# Altium schematic sheet Buzzer, LED.SchDoc
size Letter; Organization: Cegep Limoilou; Address1: 1300, 8e Avenue; Address2: Québec, QC; Address3: Canada; Address4: G1J 5L5; Revision: Enseignants; SheetNumber: 3; SheetTotal: 4; Conception: Ilyes Gharmoul; Titre: Buzzer LED Conn; Modification: Ilyes G
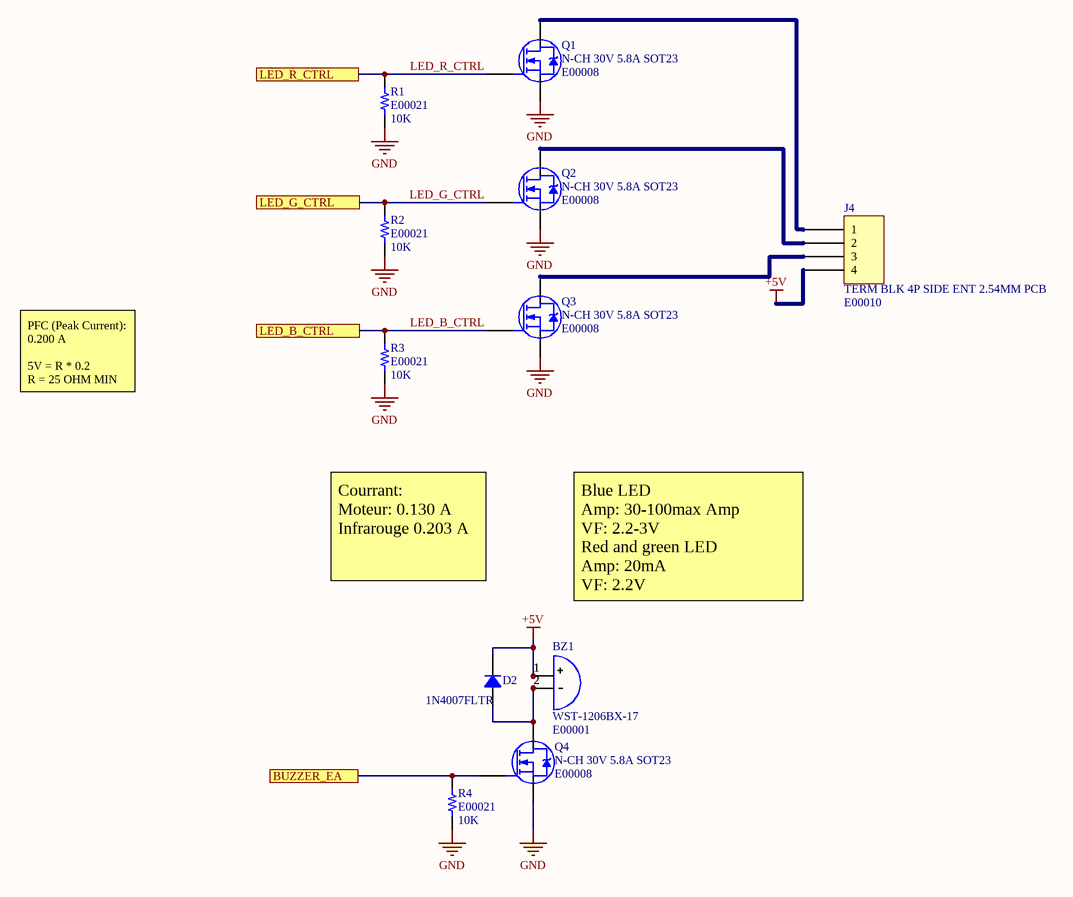
[diagram p0: Buzzer, LED.SchDoc]

## Parts
BZ1  WST-1206BX-17  ADAM Inventory Number 1: E00001  [BUZZ WST-1206BX]
D2  1N4007FLTR  [SOD123F]
J4  TERM BLK 4P SIDE ENT 2.54MM PCB  ADAM Inventory Number 1: E00010  [TERM BLOC 4P]
Q1  N-CH 30V 5.8A SOT23  ADAM Inventory Number 1: E00008  [N-CHANNEL TRANS]
Q2  N-CH 30V 5.8A SOT23  ADAM Inventory Number 1: E00008  [N-CHANNEL TRANS]
Q3  N-CH 30V 5.8A SOT23  ADAM Inventory Number 1: E00008  [N-CHANNEL TRANS]
Q4  N-CH 30V 5.8A SOT23  ADAM Inventory Number 1: E00008  [N-CHANNEL TRANS]
R1  ADAM Inventory Number 1: E00021  [RES 0603]  (hidden comment: 10K)
R2  ADAM Inventory Number 1: E00021  [RES 0603]  (hidden comment: 10K)
R3  ADAM Inventory Number 1: E00021  [RES 0603]  (hidden comment: 10K)
R4  ADAM Inventory Number 1: E00021  [RES 0603]  (hidden comment: 10K)

## Ports
BUZZER_EA, LED_B_CTRL, LED_G_CTRL, LED_R_CTRL

## Nets
+5V: BZ1.1 D2.2 J4.4
GND: Q1.2(S) Q2.2(S) Q3.2(S) Q4.2(S) R1.1 R2.1 R3.1 R4.1
BUZZER_EA: Q4.1(G) R4.2 ; port BUZZER_EA
LED_B_CTRL: Q3.1(G) R3.2 ; port LED_B_CTRL
LED_G_CTRL: Q2.1(G) R2.2 ; port LED_G_CTRL
LED_R_CTRL: Q1.1(G) R1.2 ; port LED_R_CTRL
NetBZ1_2: BZ1.2 D2.1 Q4.3(D)
NetJ4_1: J4.1 Q1.3(D)
NetJ4_2: J4.2 Q2.3(D)
NetJ4_3: J4.3 Q3.3(D)

## Notes on the sheet
- PFC (Peak Current): 0.200 A
  5V = R * 0.2
  R = 25 OHM MIN
- Courrant:
  Moteur: 0.130 A
  Infrarouge 0.203 A
- Blue LED
  Amp: 30-100max Amp
  VF: 2.2-3V
  Red and green LED
  Amp: 20mA
  VF: 2.2V
- Titre :
- Conception :
- Date :
- Modification :
- Heure :
- Révision :
- Feuille
- de
- Fichier :

## Library data of the parts
BZ1 = WST-1206BX-17: Buzzers Indicator, Internally Driven Magnetic 5 V 30mA 3.1kHz 83dB @ 5V, 10cm Through Hole PC Pins; Supplier 1: Digi-Key; Manufacturer Part Number 1: WST-1206BX-17; Supplier Part Number 1: 433-1081-ND
D2 = 1N4007FLTR: STANDARD RECTIFIER 1000V SOD-123; Manufacturer: SMC Diode Solutions; Capacitance @ Vr, F: 15pF @ 4V, 1MHz; Current - Average Rectified (Io): 1A; Current - Reverse Leakage @ Vr: 5µA @ 1000V; Speed: Standard Recovery >500ns, > 200mA (Io); Voltage - Forward (Vf) (Max) @ If: 1.1V @ 1A; Manufacturer Part Number 1: 1N4007FLTR; ComponentLink1Description: Datasheet; ComponentLink1URL: http://www.smc-diodes.com/propdf/1N4001FL-1N4007FL%20N1646%20REV.A.pdf; ComponentLink2Description: DigiKey Link; ComponentLink2URL: http://digikey.com/product-detail/en/smc-diode-solutions/1N4007FLTR/1655-1N4007FLCT-ND/11657827; Diode Type: Standard; LastUpdated: 2020-08-30 20:59:55; Lifecycle Status: Active; Minimum Order: 1; Mounting Type: Surface Mount; Package / Case: SOD-123F; Packaging: TapeAndReel; PartId: 3314; Price: 0.01; Supplier 1: DigiKey; Supplier Part Number 1: 1655-1N4007FLCT-ND; Supplier Device Package: SOD-123FL; Voltage - DC Reverse (Vr) (Max): 1000V
J4 = TERM BLK 4P SIDE ENT 2.54MM PCB: Manufacturer Part Number 1: 282834-4; Manufacturer: TE Connectivity AMP Connectors; Current: 10A; Mating Orientation: Horizontal with Board; Number of Levels: 1; Pitch: 0.100" (2.54mm); Positions Per Level: 4; Voltage: 150V; Wire Gauge: 16-30 AWG; Wire Termination: Screw - Rising Cage Clamp; Color: Green; ComponentLink1Description: Datasheet; ComponentLink1URL: https://www.te.com/commerce/DocumentDelivery/DDEController?Action=srchrtrv&DocNm=282834&DocType=Customer+Drawing&DocLang=English; ComponentLink2Description: DigiKey Link; ComponentLink2URL: http://digikey.com/product-detail/en/te-connectivity-amp-connectors/282834-4/A98335-ND/1153265; LastUpdated: 2020-01-15 04:16:05; Lifecycle Status: Active; Minimum Order: 1; Mounting Type: Through Hole; Packaging: Bulk; Part Status: Active; Price: 2.68; Series: Buchanan; Supplier 1: DigiKey; Supplier Part Number 1: A98335-ND
Q1-Q4 = TRANS N-CHANNEL 30V 5.8A SOT23: N-Channel 5.8A (Tj) 350mW Surface Mount SOT-23; Manufacturer: MCC; Manufacturer Part Number 1: SI3404-TP; Source: IC_Component.SchLib; Design Item ID: TRANS N-CHANNEL 30V 5.8A SOT23; Component Type: Transistors; Supplier 1: Digi-Key; Supplier Part Number 1: DMN3051LDICT-ND
R1-R4 = RES SMD 10K OHM: RES SMD 10K OHM 1% 1/10W 0603; Manufacturer Part Number 1: RC0603FR-0710KL; Manufacturer: Rohm Semiconductor; Power (Watts): 0.25W, 1/4W; Temperature Coefficient: ±100ppm/°C; ComponentLink1Description: Datasheet; ComponentLink1URL: https://www.rohm.com/datasheet/ESR01MZPF/esr-e; ComponentLink2Description: DigiKey Link; ComponentLink2URL: https://www.digikey.com/en/products/detail/rohm-semiconductor/ESR03EZPF1002/1983429; Composition: Thick Film; Device Package: 0603 (1608 Metric); Features: Automotive AEC-Q200, Pulse Withstanding; Height - Seated (Max): 0.022" (0.55mm); LastUpdated: 2023-03-27 19:26:49; Lifecycle Status: Active; Minimum Order: 1; Number of Terminations: 2; Operating Temperature: -55°C ~ 155°C; Package / Case: 0603 (1608 Metric); Packaging: TapeAndReel; PartId: 5466; Part Status: Active; Price: 0.02; Ratings: AEC-Q200; Resistance: 10K; Series: ESR; Size / Dimension: 0.063" L x 0.031" W (1.60mm x 0.80mm); Supplier Device Package: 0603; Tolerance: ±1%; Supplier 1: Future Electronics; Supplier Part Number 1: 3349388; Value: 10K